# EAGLE design hausbus168 (EAGLE 5.10)
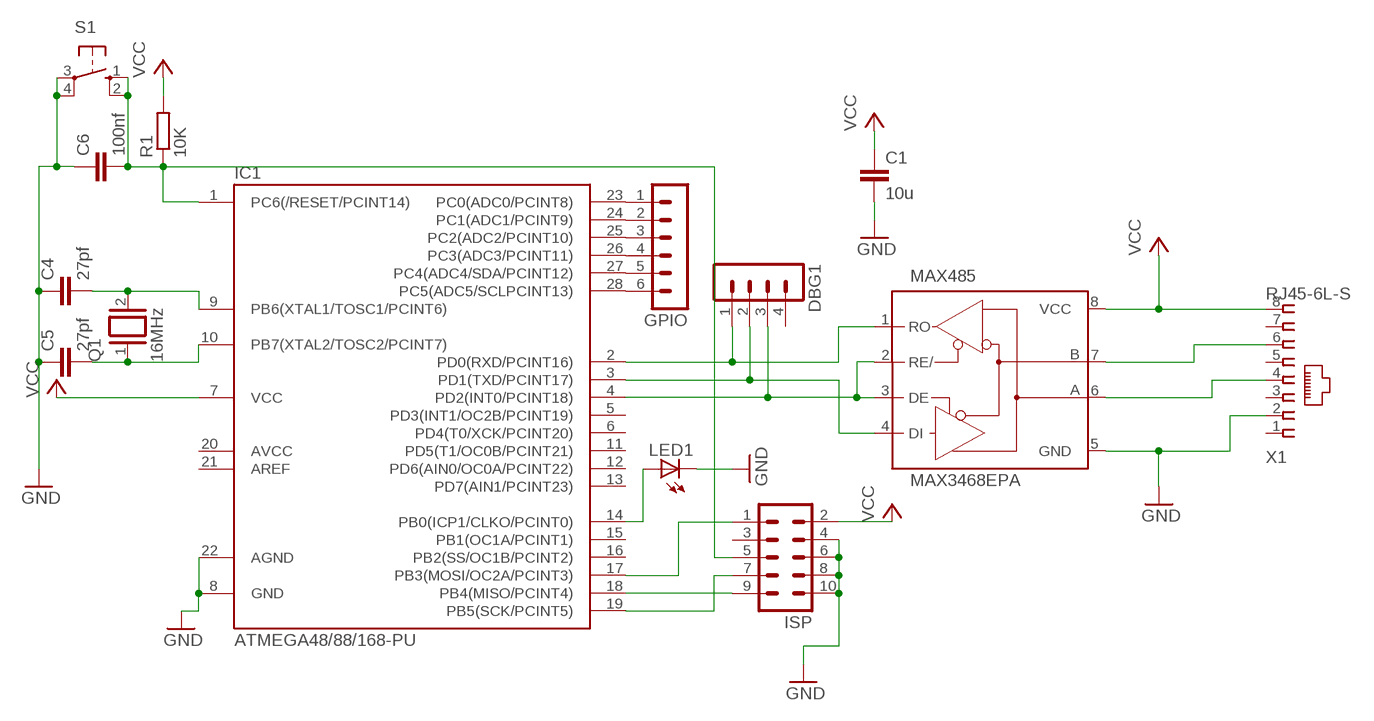
[diagram p0: schematic, sheet 1]

## Parts
C1  10u  C7.5/3  [C7.5B3]
C4  27pf  C2,5-3  [C2.5-3]
C5  27pf  C2,5-3  [C2.5-3]
C6  100nf  C2,5-3  [C2.5-3]
DBG1  MA04-1  [MA04-1]
GPIO  MA06-1  [MA06-1]
IC1  ATMEGA48/88/168-PU  [DIL28-3]
ISP  ML10  [ML10]
LED1  LED5MM  [LED5MM]
MAX485  MAX3468EPA  [DIL08]
Q1  16MHz  XTAL/S  [QS]
R1  10K  R-EU_0204/7  [0204/7]
S1  10-XX  [B3F-10XX]
X1  RJ45-6L-S  [RJ45-NO-SHIELD]

## Nets
GND: C1.2 C4.1 C5.1 C6.1 IC1.8(GND) IC1.22(AGND) ISP.4 ISP.6 ISP.8 ISP.10 LED1.K(C) MAX485.5(GND) S1.3(P) S1.4(P1) X1.2
N$1: MAX485.7(B) X1.6
N$2: DBG1.1 IC1.2(PD0(RXD/PCINT16)) MAX485.1(RO)
N$3: DBG1.2 IC1.3(PD1(TXD/PCINT17)) MAX485.4(DI)
N$4: DBG1.3 IC1.4(PD2(INT0/PCINT18)) MAX485.2(RE/) MAX485.3(DE)
N$5: IC1.17(PB3(MOSI/OC2A/PCINT3)) ISP.1
N$6: C6.2 IC1.1(PC6(/RESET/PCINT14)) ISP.5 R1.1 S1.1(S) S1.2(S1)
N$7: IC1.19(PB5(SCK/PCINT5)) ISP.7
N$8: IC1.18(PB4(MISO/PCINT4)) ISP.9
N$9: C4.2 IC1.9(PB6(XTAL1/TOSC1/PCINT6)) Q1.2
N$10: C5.2 IC1.10(PB7(XTAL2/TOSC2/PCINT7)) Q1.1
N$11: GPIO.1 IC1.23(PC0(ADC0/PCINT8))
N$12: MAX485.6(A) X1.4
N$14: GPIO.2 IC1.24(PC1(ADC1/PCINT9))
N$15: GPIO.3 IC1.25(PC2(ADC2/PCINT10))
N$16: GPIO.4 IC1.26(PC3(ADC3/PCINT11))
N$17: GPIO.5 IC1.27(PC4(ADC4/SDA/PCINT12))
N$18: GPIO.6 IC1.28(PC5(ADC5/SCLPCINT13))
N$23: IC1.14(PB0(ICP1/CLKO/PCINT0)) LED1.A
VCC: C1.1 IC1.7(VCC) ISP.2 MAX485.8(VCC) R1.2 X1.8
Unconnected: DBG1.4 IC1.5(PD3(INT1/OC2B/PCINT19)) IC1.6(PD4(T0/XCK/PCINT20)) IC1.11(PD5(T1/OC0B/PCINT21)) IC1.12(PD6(AIN0/OC0A/PCINT22)) IC1.13(PD7(AIN1/PCINT23)) IC1.15(PB1(OC1A/PCINT1)) IC1.16(PB2(SS/OC1B/PCINT2)) IC1.20(AVCC) IC1.21(AREF) ISP.3 X1.1 X1.3 X1.5 X1.7

## Library data of the parts
C1 C4-C6 = capacitor-wima:C: CAPACITOR naming: grid - package width
DBG1 = con-lstb:MA04-1: PIN HEADER
GPIO = con-lstb:MA06-1: PIN HEADER
IC1 = atmega8:ATMEGA48/88/168-PU
ISP = con-harting-ml:ML10: HARTING
LED1 = led:LED: LED OSRAM: - CHIPLED LG R971, LG N971, LY N971, LG Q971, LY Q971, LO R971, LY R971 LH N974, LH R974 LS Q976, LO Q976, LY Q976 LO Q996 - Hyper CHIPLED LW Q18S LB Q993, LB Q99A, LB R99A - SideLED LS A670, LO A670, LY A670, LG A670, LP A670 LB A673, LV A673, LT A673, LW A673 LH A674 LY A675 LS A676, LA A676, LO A676, LY A676, LW A676 LS A679, LY A679, LG A679 - Hyper Micro SIDELED® LS Y876, LA Y876, LO Y876, LY Y876 LT Y87S - SmartLED LW L88C, LW L88S LB L89C, LB L89S, LG L890 LS L89K, LO L89K, LY L89K LS L896, LA L896, LO L896, LY L896 - TOPLED LS T670, LO T670, LY T670, LG T670, LP T670 LSG T670, LSP T670, LSY T670, LOP T670, LYG T670 LG T671, LOG T671, LSG T671 LB T673, LV T673, LT T673, LW T673 LH T674 LS T676, LA T676, LO T676, LY T676, LB T676, LH T676, LSB T676, LW T676 LB T67C, LV T67C, LT T67C, LS T67K, LO T67K, LY T67K, LW E67C LS E67B, LA E67B, LO E67B, LY E67B, LB E67C, LV E67C, LT E67C LW T67C LS T679, LY T679, LG T679 LS T770, LO T770, LY T770, LG T770, LP T770 LB T773, LV T773, LT T773, LW T773 LH T774 LS E675, LA E675, LY E675, LS T675 LS T776, LA T776, LO T776, LY T776, LB T776 LHGB T686 LT T68C, LB T68C - Hyper Mini TOPLED® LB M676 - Mini TOPLED Santana® LG M470 LS M47K, LO M47K, LY M47K Source: http://www.osram.convergy.de LUXEON: - LUMILED® LXK2-PW12-R00, LXK2-PW12-S00, LXK2-PW14-U00, LXK2-PW14-V00 LXK2-PM12-R00, LXK2-PM12-S00, LXK2-PM14-U00 LXK2-PE12-Q00, LXK2-PE12-R00, LXK2-PE12-S00, LXK2-PE14-T00, LXK2-PE14-U00 LXK2-PB12-K00, LXK2-PB12-L00, LXK2-PB12-M00, LXK2-PB14-N00, LXK2-PB14-P00, LXK2-PB14-Q00 LXK2-PR12-L00, LXK2-PR12-M00, LXK2-PR14-Q00, LXK2-PR14-R00 LXK2-PD12-Q00, LXK2-PD12-R00, LXK2-PD12-S00 LXK2-PH12-R00, LXK2-PH12-S00 LXK2-PL12-P00, LXK2-PL12-Q00, LXK2-PL12-R00 Source: www.luxeon.com KINGBRIGHT: KA-3528ASYC Source: www.kingbright.com
MAX485 = maxim:MAX34*: +5V, Fail-Safe, 40Mbps, Profibus RS-485/RS-422 Transceivers Source: MAX3465-MAX3469.pdf
Q1 = special:XTAL/S: CRYSTAL
R1 = resistor:R-EU_: RESISTOR, European symbol
S1 = switch-omron:10-XX: OMRON SWITCH
X1 = con-tycoelectronics:RJ45: CORCOM Modular RJ Jacks No Shield Source: www.tycoelectronics.com .. ENG_DS_1654001_1099_RJ_L_0507.pdf

## Board
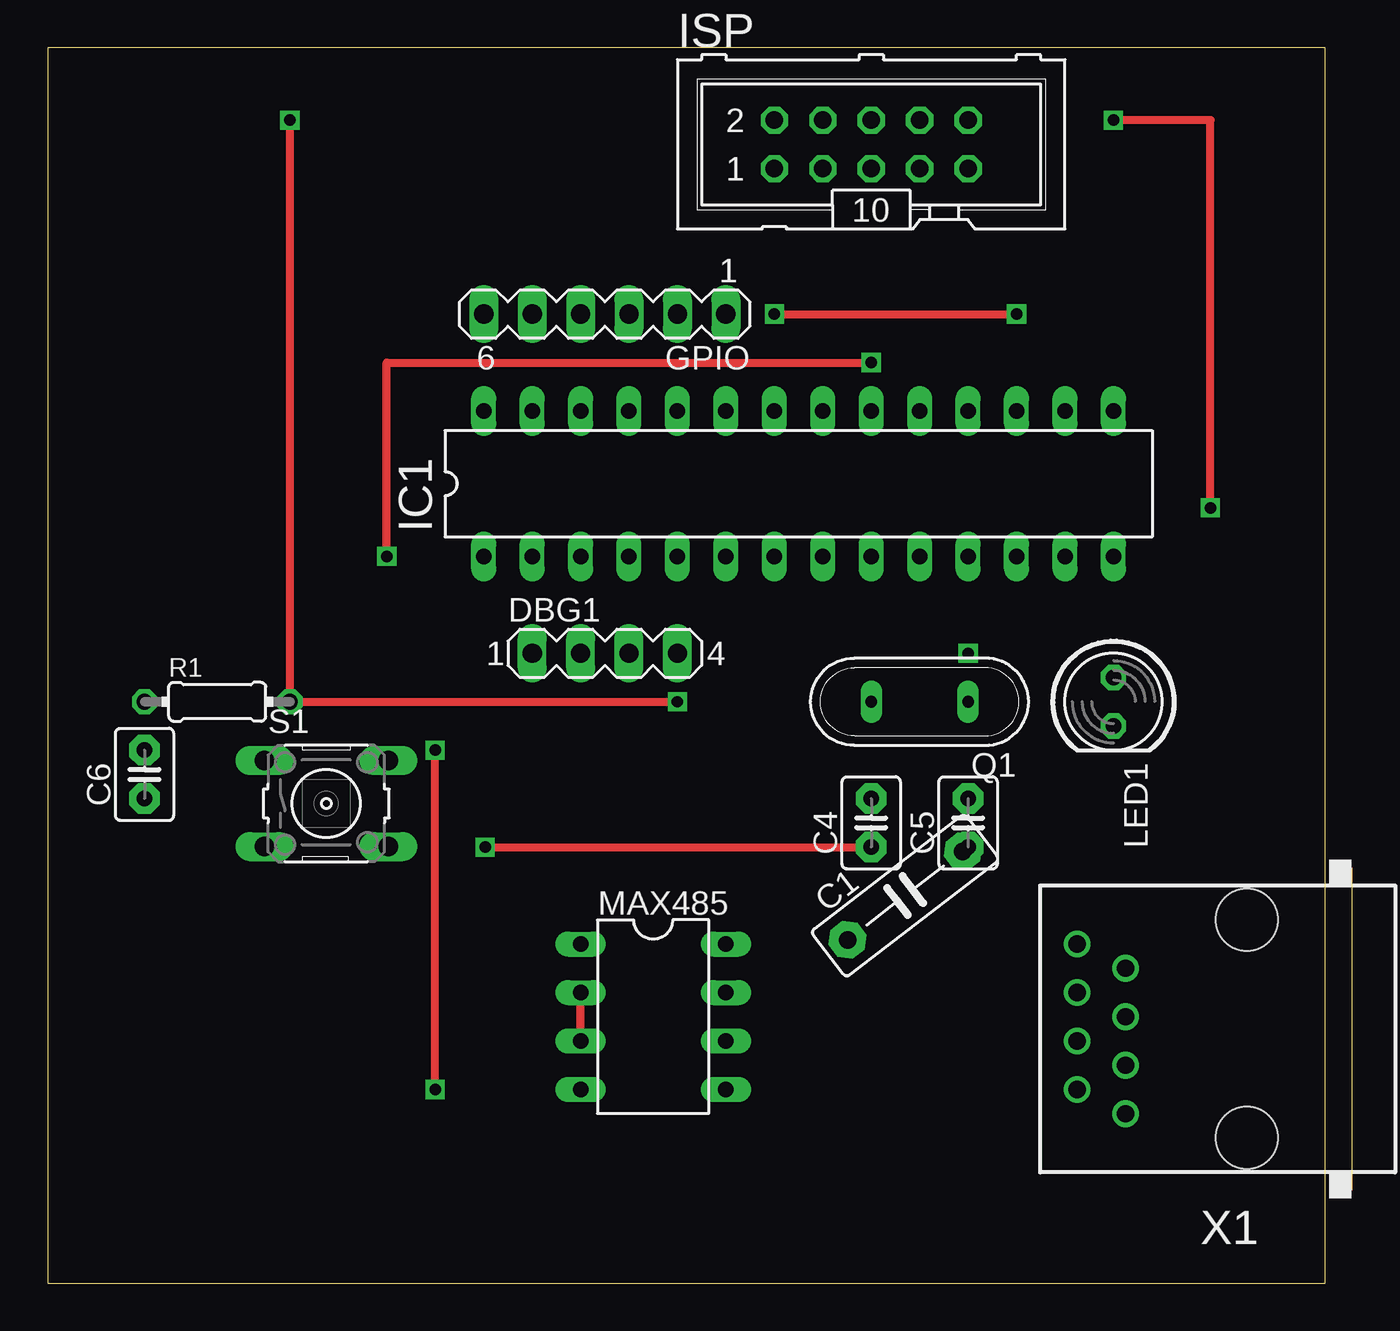
[diagram p1: board, top side]
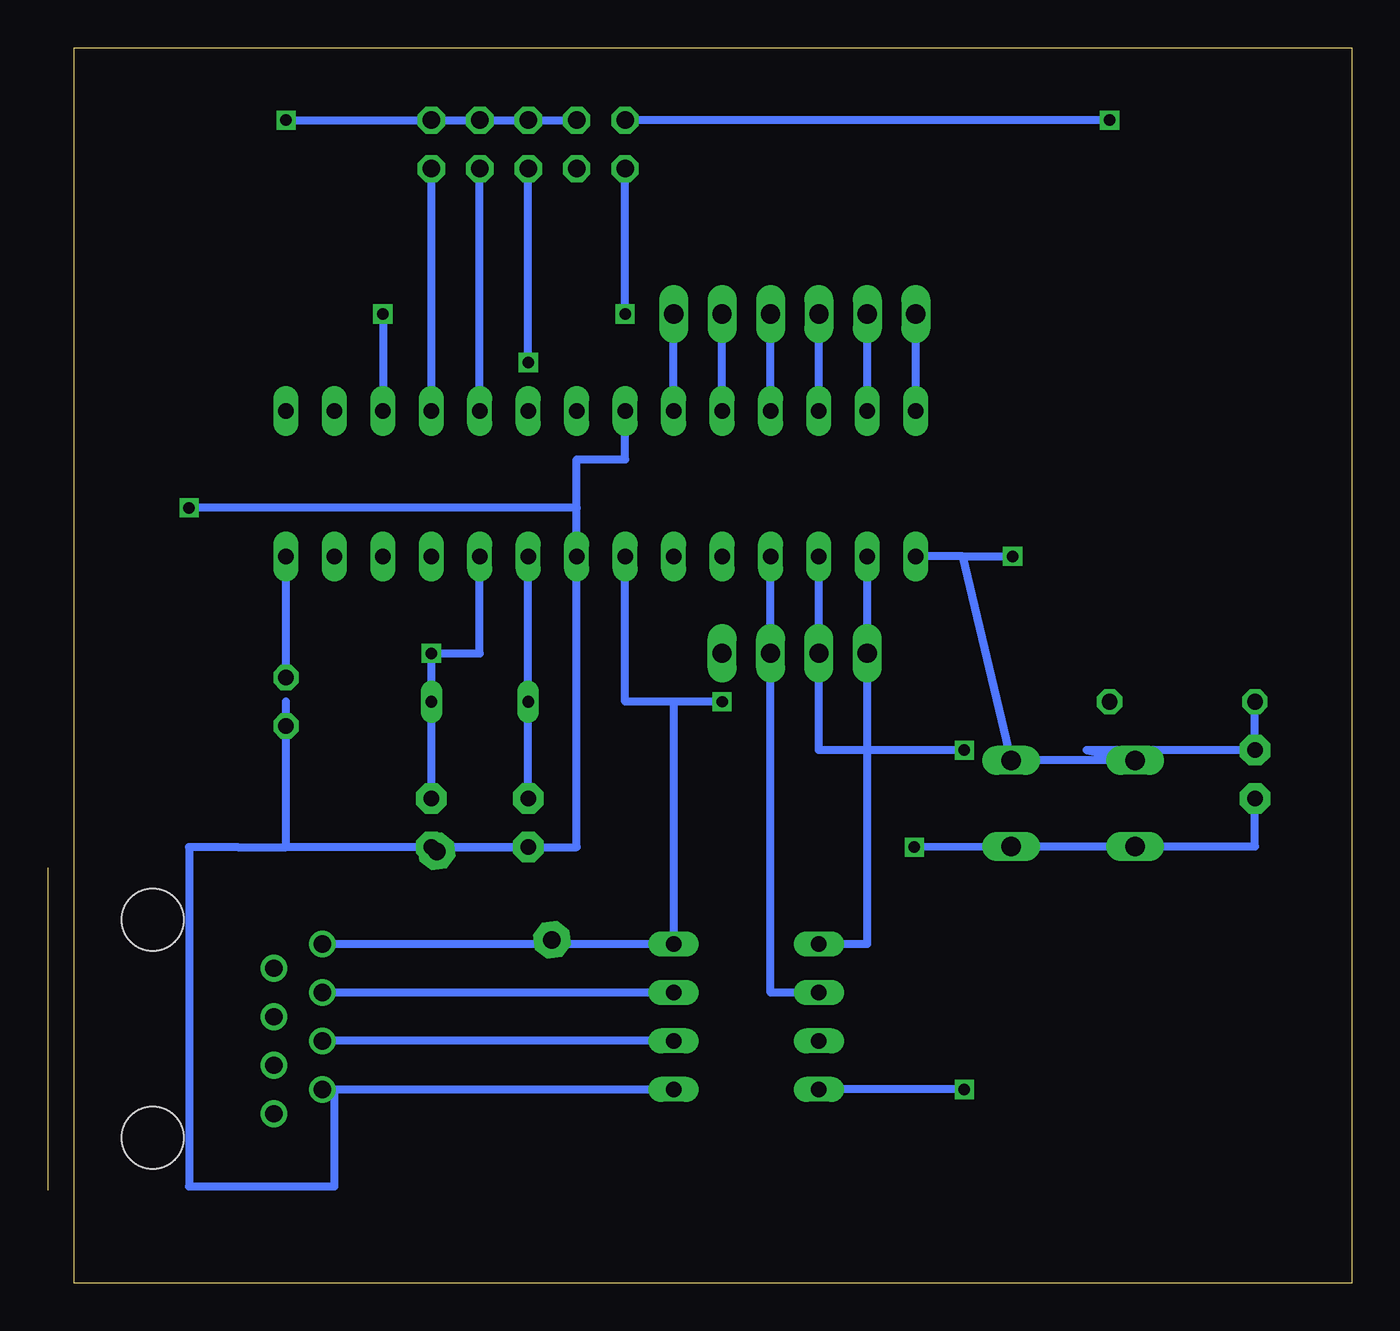
[diagram p2: board, bottom side, seen from below]

Size 66.98 x 64.76 mm. Coordinates in mm from the lower left corner, seen from the top.
Outline: 0,0 66.98,0 66.98,64.76 0,64.76 0,0
Copper layers (1*16): Top 0.035mm / dielectric 1.5mm / Bottom 0.035mm
Design rules "default *": minimum track width 10mil, minimum drill 1mil, track to track 8mil, track to pad 8mil, pad to pad 8mil, via to via 8mil, smd to smd 8mil, copper to edge 8mil, drill to drill 8mil, minimum pad ring 10mil, minimum via ring 8mil, stop-mask expansion 0mil, vias tented up to drill 0mil, thermal gap 10mil

### Footprints (pad centres in the part's own frame; a part is rotated, then mirrored left to right if it is on the bottom)
C7.5B3 = drill 0.914 pad 1.905 octagon: 1 -3.81,0; 2 3.81,0
C2.5-3 = drill 0.813 pad 1.6 octagon: 1 -1.27,0; 2 1.27,0
MA04-1 = drill 1.016 long: 1 -3.81,0; 2 -1.27,0; 3 1.27,0; 4 3.81,0
MA06-1 = drill 1.016 long: 1 -6.35,0; 2 -3.81,0; 3 -1.27,0; 4 1.27,0; 5 3.81,0; 6 6.35,0
DIL28-3 = drill 0.813 long: 1 -16.51,-3.81; 2 -13.97,-3.81; 3 -11.43,-3.81; 4 -8.89,-3.81; 5 -6.35,-3.81; 6 -3.81,-3.81; 7 -1.27,-3.81; 8 1.27,-3.81; 9 3.81,-3.81; 10 6.35,-3.81; 11 8.89,-3.81; 12 11.43,-3.81; 13 13.97,-3.81; 14 16.51,-3.81; 15 16.51,3.81; 16 13.97,3.81; 17 11.43,3.81; 18 8.89,3.81; 19 6.35,3.81; 20 3.81,3.81; 21 1.27,3.81; 22 -1.27,3.81; 23 -3.81,3.81; 24 -6.35,3.81; 25 -8.89,3.81; 26 -11.43,3.81; 27 -13.97,3.81; 28 -16.51,3.81
ML10 = drill 0.914 octagon: 1 -5.08,-1.27; 2 -5.08,1.27; 3 -2.54,-1.27; 4 -2.54,1.27; 5 0,-1.27; 6 0,1.27; 7 2.54,-1.27; 8 2.54,1.27; 9 5.08,-1.27; 10 5.08,1.27
LED5MM = drill 0.813 octagon: A -1.27,0; K 1.27,0
DIL08 = drill 0.813 long: 1 -3.81,-3.81; 2 -1.27,-3.81; 3 1.27,-3.81; 4 3.81,-3.81; 5 3.81,3.81; 6 1.27,3.81; 7 -1.27,3.81; 8 -3.81,3.81
QS = drill 0.61 long: 1 -2.54,0; 2 2.54,0
0204/7 = drill 0.813 octagon: 1 -3.81,0; 2 3.81,0
B3F-10XX = drill 1.016 long: 1 -3.251,2.261; 2 3.251,2.261; 3 -3.251,-2.261; 4 3.251,-2.261
RJ45-NO-SHIELD = drill 0.9 pad 1.4 round: 1 -4.445,6.35; 2 -3.175,8.89; 3 -1.905,6.35; 4 -0.635,8.89; 5 0.635,6.35; 6 1.905,8.89; 7 3.175,6.35; 8 4.445,8.89 | hole 3.251: -5.715,0; 5.715,0

### Placement (x,y rotation side)
C1  44.96,20.32 37.5 top
C4  43.18,24.13 90 top
C5  48.26,24.13 90 top
C6  5.08,26.67 90 top
DBG1  29.21,33.02 0 top
GPIO  29.21,50.8 180 top
IC1  39.37,41.91 0 top
ISP  43.18,59.69 0 top
LED1  55.88,30.48 270 top
MAX485  31.75,13.97 270 top
Q1  45.72,30.48 180 top
R1  8.89,30.48 0 top
S1  14.61,25.15 0 top
X1  62.87,13.34 90 top

### Tracks (layer width: path | path; a pad name or v marks a point on that pad's centre or on a via)
GND  (via drill 0.6)
  Top 0.406: v55.88,60.96 60.96,60.96 v60.96,40.64 | v22.94,22.86 C4.1
  Bottom 0.406: ISP.4 ISP.6 ISP.8 ISP.10 v55.88,60.96 | C4.1 C5.1 | C6.1 5.08,22.89 S1.3 S1.4 v22.94,22.86 | 40.64,40.64 v60.96,40.64 | 40.64,40.64 IC1.8 40.64,22.86 C5.1 | IC1.22 38.1,43.18 40.64,43.18 40.64,40.64 | C1.2 48.26,22.64 C5.1 | C5.1 55.88,22.86 | MAX485.5 X1.2 53.34,10.16 53.34,5.08 60.96,5.08 60.96,22.86 58.42,22.86 55.88,22.86 | 55.88,30.48 LED1.K 55.88,22.86
N$1
  Bottom 0.406: MAX485.7 X1.6
N$2
  Bottom 0.406: IC1.2 DBG1.1 25.4,17.78 MAX485.1
N$3  (via drill 0.6)
  Top 0.406: v20.32,10.16 v20.32,27.94
  Bottom 0.406: IC1.3 DBG1.2 27.94,27.94 v20.32,27.94 | v20.32,10.16 MAX485.4
N$4
  Top 0.406: MAX485.3 MAX485.2
  Bottom 0.406: IC1.4 DBG1.3 30.48,15.24 MAX485.2
N$5  (via drill 0.6)
  Top 0.406: v38.1,50.8 v50.8,50.8
  Bottom 0.406: v50.8,50.8 IC1.17 | v38.1,50.8 ISP.1
N$6  (via drill 0.6)
  Top 0.406: v17.78,38.1 17.78,48.26 v43.18,48.26
  Bottom 0.406: R1.1 C6.2 13.89,27.94 S1.1 S1.2 20.4,38.1 | 20.4,38.1 IC1.1 | v43.18,48.26 ISP.5 | 20.4,38.1 v17.78,38.1
N$7
  Bottom 0.406: IC1.19 ISP.7
N$8
  Bottom 0.406: IC1.18 ISP.9
N$9
  Bottom 0.406: IC1.9 Q1.2 C4.2
N$10  (via drill 0.6)
  Bottom 0.406: IC1.10 45.72,33.02 v48.26,33.02 Q1.1 C5.2
N$11
  Bottom 0.406: IC1.23 GPIO.1
N$12
  Bottom 0.406: MAX485.6 X1.4
N$14
  Bottom 0.406: IC1.24 GPIO.2
N$15
  Bottom 0.406: IC1.25 GPIO.3
N$16
  Bottom 0.406: IC1.26 GPIO.4
N$17
  Bottom 0.406: IC1.27 GPIO.5
N$18
  Bottom 0.406: IC1.28 GPIO.6
N$23
  Bottom 0.406: LED1.A IC1.14
VCC  (via drill 0.6)
  Top 0.406: v33.02,30.48 R1.2 v12.7,60.96
  Bottom 0.406: v33.02,30.48 35.56,30.48 | 35.56,30.48 38.1,30.48 IC1.7 | 41.94,17.78 X1.8 | 41.94,17.78 MAX485.8 35.56,30.48 | 41.94,17.78 C1.1 | v12.7,60.96 ISP.2